# EAGLE design sumobot2 (EAGLE 6.5.0)
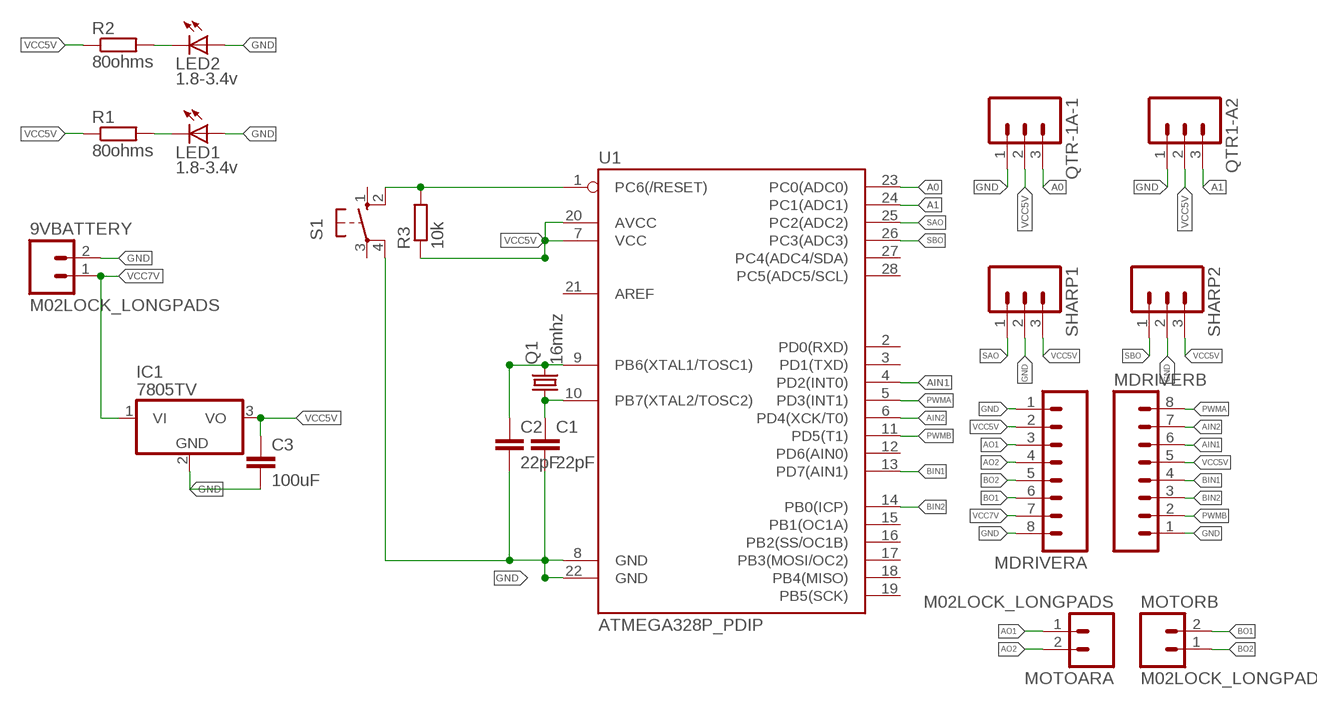
[diagram p0: schematic, sheet 1]

## Parts
9VBATTERY  M02LOCK_LONGPADS  [1X02_LOCK_LONGPADS]
C1  22pF  C-EU025-025X050  [C025-025X050]
C2  22pF  C-EU025-025X050  [C025-025X050]
C3  100uF  C-EU025-025X050  [C025-025X050]
IC1  7805TV  [TO220V]
LED1  1.8-3.4v  LED3MM  [LED3MM]
LED2  1.8-3.4v  LED3MM  [LED3MM]
MDRIVERA  M08LONGPADS  [1X08_LONGPADS]
MDRIVERB  M08LONGPADS  [1X08_LONGPADS]
MOTOARA  M02LOCK_LONGPADS  [1X02_LOCK_LONGPADS]
MOTORB  M02LOCK_LONGPADS  [1X02_LOCK_LONGPADS]
Q1  16mhz  CRYSTALHC49U70  [HC49U70]
QTR1-A2  M03LONGPADS  [1X03_LONGPADS]
QTR-1A-1  M03LONGPADS  [1X03_LONGPADS]
R1  80ohms  R-EU_0207/10  [0207/10]
R2  80ohms  R-EU_0207/10  [0207/10]
R3  10k  R-EU_0207/10  [0207/10]
S1  10-XX  [B3F-10XX]
SHARP1  M03LONGPADS  [1X03_LONGPADS]
SHARP2  M03LONGPADS  [1X03_LONGPADS]
U1  ATMEGA328P_PDIP  [DIL28-3]

## Nets
A0: QTR-1A-1.3 U1.23(PC0(ADC0))
A1: QTR1-A2.3 U1.24(PC1(ADC1))
AIN1: MDRIVERB.6 U1.4(PD2(INT0))
AIN2: MDRIVERB.7 U1.6(PD4(XCK/T0))
AO1: MDRIVERA.3 MOTOARA.1
AO2: MDRIVERA.4 MOTOARA.2
BIN1: MDRIVERB.4 U1.13(PD7(AIN1))
BIN2: MDRIVERB.3 U1.14(PB0(ICP))
BO1: MDRIVERA.6 MOTORB.2
BO2: MDRIVERA.5 MOTORB.1
GND: 9VBATTERY.2 C1.2 C2.2 C3.2 IC1.2(GND) LED1.A LED2.A MDRIVERA.1 MDRIVERA.8 MDRIVERB.1 QTR1-A2.1 QTR-1A-1.1 S1.4(P1) SHARP1.2 SHARP2.2 U1.8(GND) U1.22(GND)
N$1: C2.1 Q1.2 U1.9(PB6(XTAL1/TOSC1))
N$2: LED1.K(C) R1.2
N$3: C1.1 Q1.1 U1.10(PB7(XTAL2/TOSC2))
N$4: R3.2 S1.2(S1) U1.1(PC6(/RESET))
N$5: LED2.K(C) R2.2
PWMA: MDRIVERB.8 U1.5(PD3(INT1))
PWMB: MDRIVERB.2 U1.11(PD5(T1))
SAO: SHARP1.1 U1.25(PC2(ADC2))
SBO: SHARP2.1 U1.26(PC3(ADC3))
VCC5V: C3.1 IC1.3(VO) MDRIVERA.2 MDRIVERB.5 QTR1-A2.2 QTR-1A-1.2 R1.1 R2.1 R3.1 SHARP1.3 SHARP2.3 U1.7(VCC) U1.20(AVCC)
VCC7V: 9VBATTERY.1 IC1.1(VI) MDRIVERA.7
Unconnected: S1.1(S) S1.3(P) U1.2(PD0(RXD)) U1.3(PD1(TXD)) U1.12(PD6(AIN0)) U1.15(PB1(OC1A)) U1.16(PB2(SS/OC1B)) U1.17(PB3(MOSI/OC2)) U1.18(PB4(MISO)) U1.19(PB5(SCK)) U1.21(AREF) U1.27(PC4(ADC4/SDA)) U1.28(PC5(ADC5/SCL))

## Library data of the parts
9VBATTERY MOTOARA MOTORB = SparkFun-Connectors:M02: Standard 2-pin 0.1" header. Use with - straight break away headers ( PRT-00116) - right angle break away headers (PRT-00553) - swiss pins (PRT-00743) - machine pins (PRT-00117) - female headers (PRT-00115) Molex polarized connector foot print use with: PRT-08233 with associated crimp pins and housings. 2.54_SCREWTERM for use with PRT-10571. 3.5mm Screw Terminal footprints for PRT-08084 5mm Screw Terminal footprints for use with PRT-08433
C1-C3 = rcl:C-EU: CAPACITOR, European symbol
IC1 = linear:78*: Positive VOLTAGE REGULATOR Source: http://cache.national.com/ds/LM/LM78L05.pdf http://www.fairchildsemi.com/ds/LM/LM7805.pdf
LED1 LED2 = led:LED: LED OSRAM: - CHIPLED LG R971, LG N971, LY N971, LG Q971, LY Q971, LO R971, LY R971 LH N974, LH R974 LS Q976, LO Q976, LY Q976 LO Q996 - Hyper CHIPLED LW Q18S LB Q993, LB Q99A, LB R99A - SideLED LS A670, LO A670, LY A670, LG A670, LP A670 LB A673, LV A673, LT A673, LW A673 LH A674 LY A675 LS A676, LA A676, LO A676, LY A676, LW A676 LS A679, LY A679, LG A679 - Hyper Micro SIDELED® LS Y876, LA Y876, LO Y876, LY Y876 LT Y87S - SmartLED LW L88C, LW L88S LB L89C, LB L89S, LG L890 LS L89K, LO L89K, LY L89K LS L896, LA L896, LO L896, LY L896 - TOPLED LS T670, LO T670, LY T670, LG T670, LP T670 LSG T670, LSP T670, LSY T670, LOP T670, LYG T670 LG T671, LOG T671, LSG T671 LB T673, LV T673, LT T673, LW T673 LH T674 LS T676, LA T676, LO T676, LY T676, LB T676, LH T676, LSB T676, LW T676 LB T67C, LV T67C, LT T67C, LS T67K, LO T67K, LY T67K, LW E67C LS E67B, LA E67B, LO E67B, LY E67B, LB E67C, LV E67C, LT E67C LW T67C LS T679, LY T679, LG T679 LS T770, LO T770, LY T770, LG T770, LP T770 LB T773, LV T773, LT T773, LW T773 LH T774 LS E675, LA E675, LY E675, LS T675 LS T776, LA T776, LO T776, LY T776, LB T776 LHGB T686 LT T68C, LB T68C - Hyper Mini TOPLED® LB M676 - Mini TOPLED Santana® LG M470 LS M47K, LO M47K, LY M47K Source: http://www.osram.convergy.de LUXEON: - LUMILED® LXK2-PW12-R00, LXK2-PW12-S00, LXK2-PW14-U00, LXK2-PW14-V00 LXK2-PM12-R00, LXK2-PM12-S00, LXK2-PM14-U00 LXK2-PE12-Q00, LXK2-PE12-R00, LXK2-PE12-S00, LXK2-PE14-T00, LXK2-PE14-U00 LXK2-PB12-K00, LXK2-PB12-L00, LXK2-PB12-M00, LXK2-PB14-N00, LXK2-PB14-P00, LXK2-PB14-Q00 LXK2-PR12-L00, LXK2-PR12-M00, LXK2-PR14-Q00, LXK2-PR14-R00 LXK2-PD12-Q00, LXK2-PD12-R00, LXK2-PD12-S00 LXK2-PH12-R00, LXK2-PH12-S00 LXK2-PL12-P00, LXK2-PL12-Q00, LXK2-PL12-R00 Source: www.luxeon.com KINGBRIGHT: KA-3528ASYC Source: www.kingbright.com
MDRIVERA MDRIVERB = SparkFun-Connectors:M08: Header 8 Standard 8-pin 0.1" header. Use with straight break away headers (SKU : PRT-00116), right angle break away headers (PRT-00553), swiss pins (PRT-00743), machine pins (PRT-00117), and female headers (PRT-00115).
Q1 = crystal:CRYSTAL: CRYSTAL; OC_FARNELL: unknown; OC_NEWARK: unknown
QTR1-A2 QTR-1A-1 SHARP1 SHARP2 = SparkFun-Connectors:M03: Header 3 Standard 3-pin 0.1" header. Use with straight break away headers (SKU : PRT-00116), right angle break away headers (PRT-00553), swiss pins (PRT-00743), machine pins (PRT-00117), and female headers (PRT-00115). Molex polarized connector foot print use with SKU : PRT-08232 with associated crimp pins and housings.
R1-R3 = rcl:R-EU_: RESISTOR, European symbol
S1 = switch-omron:10-XX: OMRON SWITCH; MPN: B3F-1000; OC_FARNELL: 176432; OC_NEWARK: 36M3542
U1 = SparkFun-DigitalIC:ATMEGA328P_PDIP: uC used in the Arduino 32kb flash, 1k EEPROM, 2k SRAM This is the through-hole version of this chip.

## Board
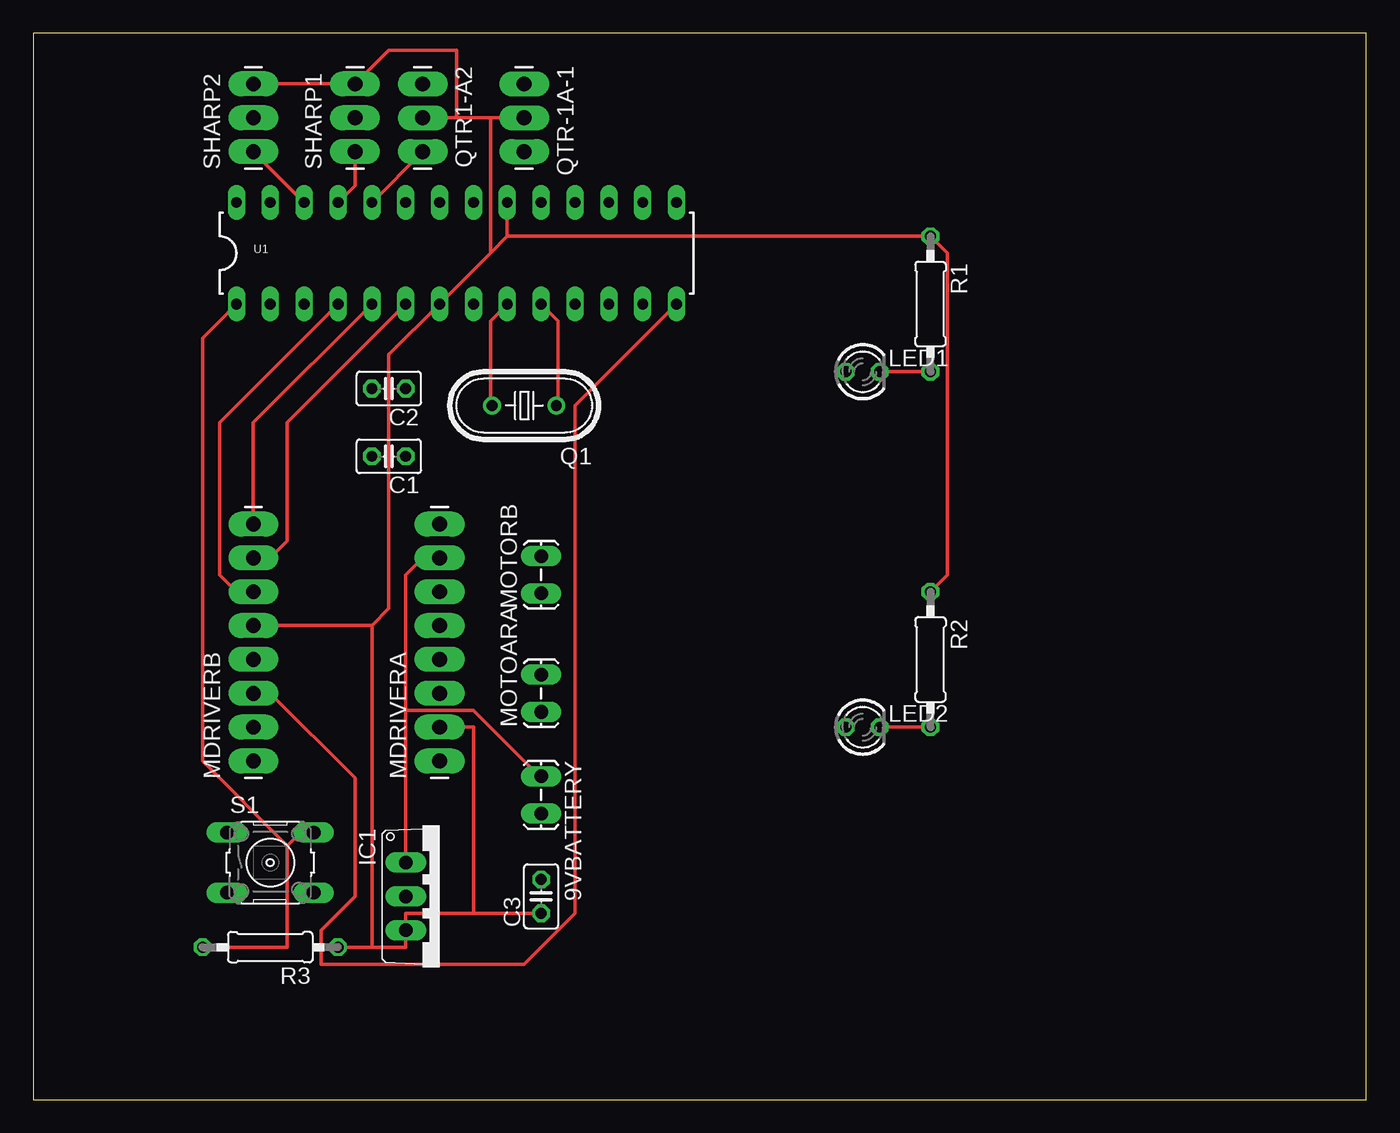
[diagram p1: board, top side]
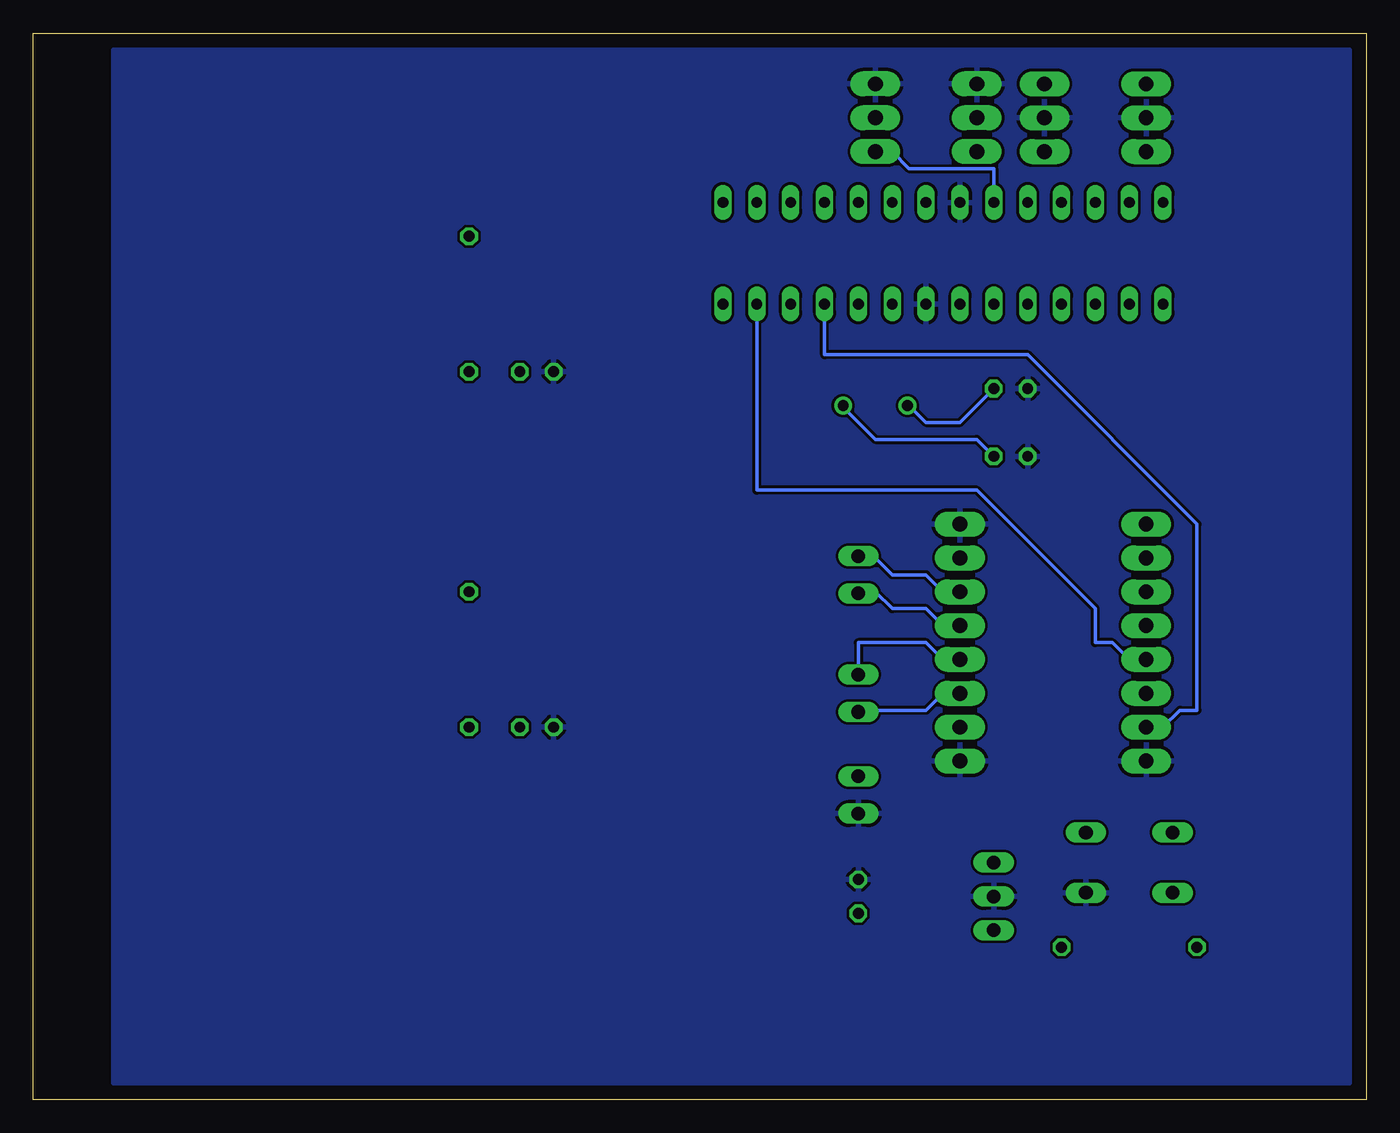
[diagram p2: board, bottom side, seen from below]

Size 100 x 80 mm. Coordinates in mm from the lower left corner, seen from the top.
Outline: 0,0 100,0 100,80 0,80 0,0
Copper layers (1*16): Top 0.035mm / dielectric 1.5mm / Bottom 0.035mm
Design rules "default": minimum track width 10mil, minimum drill 24mil, track to track 8mil, track to pad 8mil, pad to pad 8mil, via to via 8mil, smd to smd 8mil, copper to edge 40mil, drill to drill 8mil, minimum pad ring 10mil, minimum via ring 8mil, stop-mask expansion 4mil, vias tented up to drill 0mil, thermal gap 10mil

### Footprints (pad centres in the part's own frame; a part is rotated, then mirrored left to right if it is on the bottom)
1X02_LOCK_LONGPADS = drill 1.016 long: 1 -0.127,0; 2 2.667,0
C025-025X050 = drill 0.813 octagon: 1 -1.27,0; 2 1.27,0
TO220V = drill 1.016 long: 1 -2.54,-2.54; 2 0,-2.54; 3 2.54,-2.54
LED3MM = drill 0.813 octagon: A -1.27,0; K 1.27,0
1X08_LONGPADS = drill 1.118 pad 1.88 long: 1 0,0; 2 2.54,0; 3 5.08,0; 4 7.62,0; 5 10.16,0; 6 12.7,0; 7 15.24,0; 8 17.78,0
HC49U70 = drill 0.813: 1 -2.413,0; 2 2.413,0
1X03_LONGPADS = drill 1.118 pad 1.88 long: 1 0,0; 2 2.54,0; 3 5.08,0
0207/10 = drill 0.813 octagon: 1 -5.08,0; 2 5.08,0
B3F-10XX = drill 1.016 long: 1 -3.251,2.261; 2 3.251,2.261; 3 -3.251,-2.261; 4 3.251,-2.261
DIL28-3 = drill 0.813 long: 1 -16.51,-3.81; 2 -13.97,-3.81; 3 -11.43,-3.81; 4 -8.89,-3.81; 5 -6.35,-3.81; 6 -3.81,-3.81; 7 -1.27,-3.81; 8 1.27,-3.81; 9 3.81,-3.81; 10 6.35,-3.81; 11 8.89,-3.81; 12 11.43,-3.81; 13 13.97,-3.81; 14 16.51,-3.81; 15 16.51,3.81; 16 13.97,3.81; 17 11.43,3.81; 18 8.89,3.81; 19 6.35,3.81; 20 3.81,3.81; 21 1.27,3.81; 22 -1.27,3.81; 23 -3.81,3.81; 24 -6.35,3.81; 25 -8.89,3.81; 26 -11.43,3.81; 27 -13.97,3.81; 28 -16.51,3.81

### Placement (x,y rotation side)
9VBATTERY  38.1,24.13 270 top
C1  26.67,48.26 180 top
C2  26.67,53.34 180 top
C3  38.1,15.24 90 top
IC1  30.48,15.24 270 top
LED1  62.23,54.61 0 top
LED2  62.23,27.94 0 top
MDRIVERA  30.48,25.4 90 top
MDRIVERB  16.51,25.4 90 top
MOTOARA  38.1,29.21 90 top
MOTORB  38.1,38.1 90 top
Q1  36.83,52.07 180 top
QTR1-A2  29.21,76.2 270 top
QTR-1A-1  36.83,76.2 270 top
R1  67.31,59.69 270 top
R2  67.31,33.02 270 top
R3  17.78,11.43 180 top
S1  17.78,17.78 0 top
SHARP1  24.13,71.12 90 top
SHARP2  16.51,71.12 90 top
U1  31.75,63.5 0 top

### Tracks (layer width: path | path; a pad name or v marks a point on that pad's centre or on a via)
A0
  Bottom 0.254: U1.23 27.94,69.85 34.29,69.85 35.56,71.12 QTR-1A-1.3
A1
  Top 0.254: QTR1-A2.3 U1.24
AIN1
  Top 0.254: U1.4 13.97,50.8 13.97,39.37 15.24,38.1 MDRIVERB.6
AIN2
  Top 0.254: U1.6 19.05,50.8 19.05,41.91 17.78,40.64 MDRIVERB.7
AO1
  Bottom 0.254: MDRIVERA.3 31.75,30.48 33.02,29.21 38.1,29.21 MOTOARA.1
AO2
  Bottom 0.254: MDRIVERA.4 31.75,33.02 33.02,34.29 38.1,34.29 MOTOARA.2 38.1,31.75
BIN1
  Bottom 0.254: U1.13 45.72,45.72 29.21,45.72 20.32,36.83 20.32,34.29 19.05,34.29 17.78,33.02 MDRIVERB.4
BIN2
  Top 0.254: U1.14 40.64,52.07 40.64,13.97 36.83,10.16 21.59,10.16 21.59,12.7 24.13,15.24 24.13,24.13 17.78,30.48 MDRIVERB.3
BO1
  Bottom 0.254: MDRIVERA.6 31.75,38.1 33.02,39.37 35.56,39.37 36.83,40.64 38.1,40.64 MOTORB.2
BO2
  Bottom 0.254: MDRIVERA.5 31.75,35.56 33.02,36.83 35.56,36.83 36.83,38.1 38.1,38.1 MOTORB.1
GND
  pour Bottom: 1.27,78.74 93.98,78.74 93.98,1.27 1.27,1.27
N$1
  Top 0.254: U1.9 34.29,58.42 34.29,52.07 Q1.2
  Bottom 0.254: C2.1 30.48,50.8 33.02,50.8 34.29,52.07 Q1.2
N$2
  Top 0.254: R1.2 LED1.K
N$3
  Top 0.254: U1.10 39.37,58.42 39.37,52.07 Q1.1
  Bottom 0.254: C1.1 29.21,49.53 36.83,49.53 39.37,52.07 Q1.1
N$4
  Top 0.254: R3.2 19.05,11.43 19.05,19.05 | 19.05,19.05 20.32,20.32 S1.2 | U1.1 12.7,57.15 12.7,25.4 19.05,19.05
N$5
  Top 0.254: R2.2 LED2.K
PWMA
  Top 0.254: U1.5 16.51,50.8 MDRIVERB.8
PWMB
  Bottom 0.254: U1.11 40.64,55.88 25.4,55.88 12.7,43.18 12.7,29.21 13.97,29.21 15.24,27.94 MDRIVERB.2
SAO
  Top 0.254: U1.25 24.13,68.58 SHARP1.1
SBO
  Top 0.254: SHARP2.1 U1.26
VCC5V
  Top 0.254: 25.4,11.43 27.94,11.43 IC1.3 27.94,13.97 33.02,13.97 | 25.4,11.43 R3.1 | 33.02,13.97 C3.1 | 25.4,35.56 MDRIVERB.5 | 25.4,11.43 25.4,35.56 | MDRIVERA.2 33.02,27.94 33.02,13.97 | R2.1 68.58,39.37 68.58,63.5 R1.1 35.56,64.77 | SHARP2.3 SHARP1.3 26.67,78.74 31.75,78.74 31.75,73.66 | QTR-1A-1.2 34.29,73.66 | 34.29,73.66 31.75,73.66 | 31.75,73.66 QTR1-A2.2 | 35.56,64.77 34.29,63.5 | 34.29,63.5 U1.7 26.67,55.88 26.67,36.83 25.4,35.56 | U1.20 35.56,64.77 | 34.29,63.5 34.29,73.66
VCC7V
  Top 0.254: 27.94,29.21 27.94,39.37 29.21,40.64 MDRIVERA.7 | 27.94,29.21 IC1.1 | 27.94,29.21 33.02,29.21 38.1,24.13 9VBATTERY.1